# EAGLE schematic LightClockDiagram (EAGLE 9.6.2)
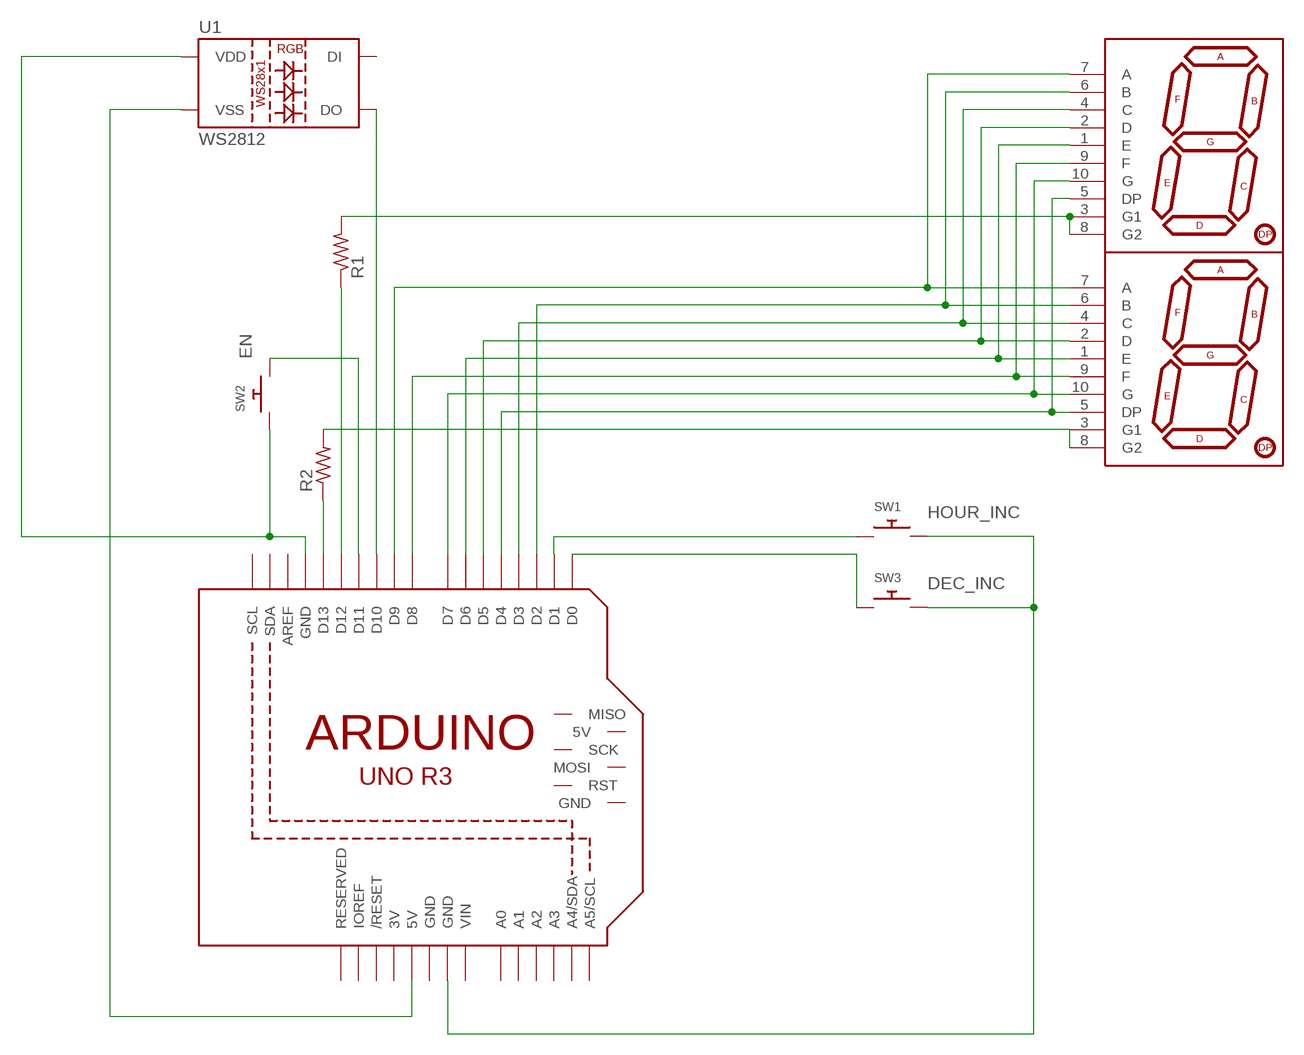
[diagram p0: schematic, sheet 1]

## Parts
M1  ARDUINO_R3_ICSP_NODIM  [ARDUINOR3_ICSP_NODIM]
R1  R-US_0204/5  [0204/5]
R2  R-US_0204/5  [0204/5]
SW1  SWITCH_PUSHBUTTONSOFTTOUCHSMD_SJ  [PUSHBUTTON_SMD_SJ]
SW2  SWITCH_PUSHBUTTONSOFTTOUCHSMD_SJ  [PUSHBUTTON_SMD_SJ]
SW3  SWITCH_PUSHBUTTONSOFTTOUCHSMD_SJ  [PUSHBUTTON_SMD_SJ]
U1  WS2812  WS2812"  [LED-TRICOLOR-5050-IC]
U$1  YSD-1601AR4B-8  7-SEGMENT-1DIGIT-1INCH-RED-EZ  [7-SEGMENT-1"PTH-EZ]
U$2  YSD-1601AR4B-8  7-SEGMENT-1DIGIT-1INCH-RED-EZ  [7-SEGMENT-1"PTH-EZ]

## Nets
N$1: R1.2 U$1.3(G1) U$1.8(G2)
N$2: R2.2 U$2.3(G1) U$2.8(G2)
N$3: M1.D13 R2.1
N$4: M1.D12 R1.1
N$5: M1.D9 U$1.7(A) U$2.7(A)
N$6: M1.D2 U$1.6(B) U$2.6(B)
N$7: M1.D3 U$1.4(C) U$2.4(C)
N$8: M1.D5 U$1.2(D) U$2.2(D)
N$9: M1.D6 U$1.1(E) U$2.1(E)
N$10: M1.D8 U$1.9(F) U$2.9(F)
N$11: M1.D7 U$1.10(G) U$2.10(G)
N$12: M1.D4 U$1.5(DP) U$2.5(DP)
N$13: M1.D1 SW1.P$1
N$14: M1.D0 SW3.P$1
N$15: M1.GND@3(GND) SW1.P$2 SW3.P$2
N$16: M1.D11 SW2.P$2
N$17: M1.GND SW2.P$1 U1.3(VDD) U1.5(VDD)
N$19: M1.5V U1.6(VSS)
N$20: M1.D10 U1.1(DO)
Unconnected: M1.5V_ICSP(5V) M1.A0 M1.A1 M1.A2 M1.A3 M1.A4(A4/SDA) M1.A5(A5/SCL) M1.AREF M1.GND@2(GND) M1.IOREF M1.MISO M1.MOSI M1.RESERVED M1.RESET(/RESET) M1.RESET_ICSP(RST) M1.SCK M1.SCL M1.SDA U1.2(DI)

## Power pins joined to a net without a drawn wire
3V: M1.3V
GND: M1.GND@1(GND)
VIN: M1.VIN

## Library data of the parts
M1 = adafruit:ARDUINO_R3_ICSP
R1 R2 = adafruit:R-US_: RESISTOR, American symbol
SW1-SW3 = adafruit:SWITCH_PUSHBUTTON: Buttons SOFTTOUCHSMD_SJ - Soft touch temporary push button (Super Junk Akihabara) Compatible with SKPMANE010 [Mouser: 688-SKPMAN] C&K_KSS = Digikey: KSS221GLFS
U1 = SparkFun-LED:WS2812: WS2812 RGB LED w/ WS2811 driver 5x5mm SMD LED with built-in controller IC. Color: Red/Green/Blue mC Rating: RGB: 550, 1100, 200 mcd Current:RGB: 20, 20, 20 mA Forward Voltage: RGB: 1.8, 3.0, 3.2 V Packages:LED-TRICOLOR-5050-IC SparkFun Products: LED-SMD RGB (WS2812) <https://www.sparkfun.com/products/11821>; PROD_ID: DIO-11598
U$1 U$2 = SparkFun-LED:7-SEGMENT-1DIGIT-1INCH: 7-Segment Display, single digit, 1" EZ is for kits. Pads are only exposed on the bottom side to help prevent soldering in upside down. Datasheet (Red) <https://cdn.sparkfun.com/datasheets/Components/LED/YSD-160AR4B-8.pdf> Datasheet (Blue) <https://cdn.sparkfun.com/datasheets/Components/LED/YSD-160AB3C-8.pdf> SparkFun Products 7-Segment Display - LED (Red) <https://www.sparkfun.com/products/8546> (COM-08546) 7-Segment Display - LED (Blue) <https://www.sparkfun.com/products/9191> (COM-09191); PROD_ID: COMP-08615

## Module BREADBOARD
Ports: TEST(io)

### Library data of the parts